# EAGLE design HoodBoard V1 (EAGLE 7.3.0)
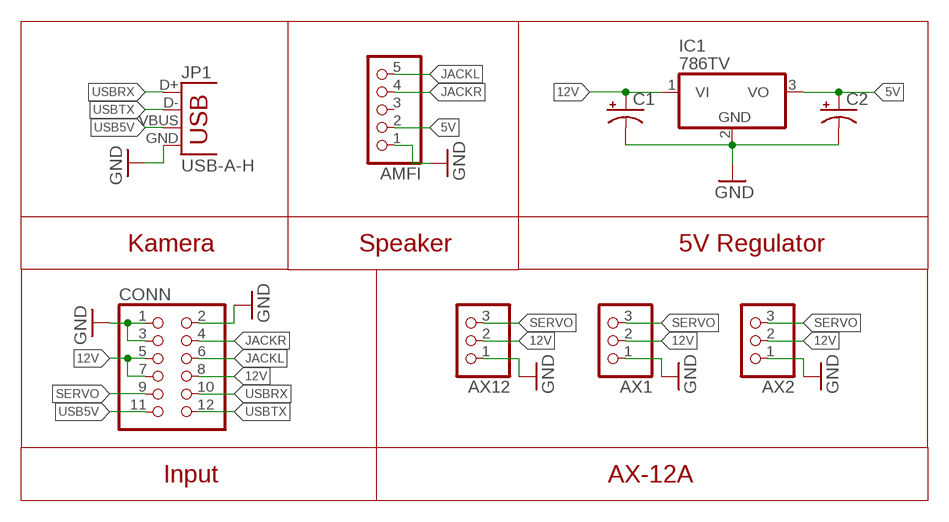
[diagram p0: schematic, sheet 1]

## Parts
AMFI  PINHD-1X5  [1X05]
AX1  PINHD-1X3  [1X03]
AX2  PINHD-1X3  [1X03]
AX12  PINHD-1X3  [1X03]
C1  10UF-25V-20%(PTH)  [CPOL-RADIAL-10UF-25V]
C2  10UF-25V-20%(PTH)  [CPOL-RADIAL-10UF-25V]
CONN  PINHD-2X6  [2X06]
IC1  786TV  [TO220V]
JP1  USB-A-H  [USB-A-H]

## Nets
5V: AMFI.2 C2.1(+) IC1.3(VO)
12V: AX1.2 AX2.2 AX12.2 C1.1(+) CONN.5 CONN.7 CONN.8 IC1.1(VI)
GND: AMFI.1 AX1.1 AX2.1 AX12.1 C1.2(-) C2.2(-) CONN.1 CONN.2 CONN.3 IC1.2(GND) JP1.GND
JACKL: AMFI.5 CONN.6
JACKR: AMFI.4 CONN.4
SERVO: AX1.3 AX2.3 AX12.3 CONN.9
USB5V: CONN.11 JP1.VBUS
USBRX: CONN.10 JP1.D+
USBTX: CONN.12 JP1.D-
Unconnected: AMFI.3

## Notes on the sheet
- Kamera | Speaker | 5V Regulator
- Input | AX-12A

## Library data of the parts
AMFI = pinhead:PINHD-1X5: PIN HEADER
AX1 AX2 AX12 = pinhead:PINHD-1X3: PIN HEADER
C1 C2 = SparkFun-Cap:10UF-25V-20%(PTH): CAP-08440; PROD_ID: CAP-08440
CONN = pinhead:PINHD-2X6: PIN HEADER
IC1 = linear:78*: Positive VOLTAGE REGULATOR Source: http://cache.national.com/ds/LM/LM78L05.pdf http://www.fairchildsemi.com/ds/LM/LM7805.pdf
JP1 = SparkFun-Connectors:USB: USB Connectors USB-B-PTH is fully proven SKU : PRT-00139/CONN-08278 USB-miniB is fully proven SKU : PRT-00587 USB-A-PCB is untested. USB-A-H is throughly reviewed, but untested. Spark Fun Electronics SKU : PRT-00437 USB-B-SMT is throughly reviewed, but untested. Needs silkscreen touching up. USB-A-S has not been used/tested USB-MB-H has not been used/tested USB-MICROB has been used. CONN-09505; PROD_ID: CONN-08367

## Net classes
0 default: width 0.4 mm, drill 1 mm

## Board
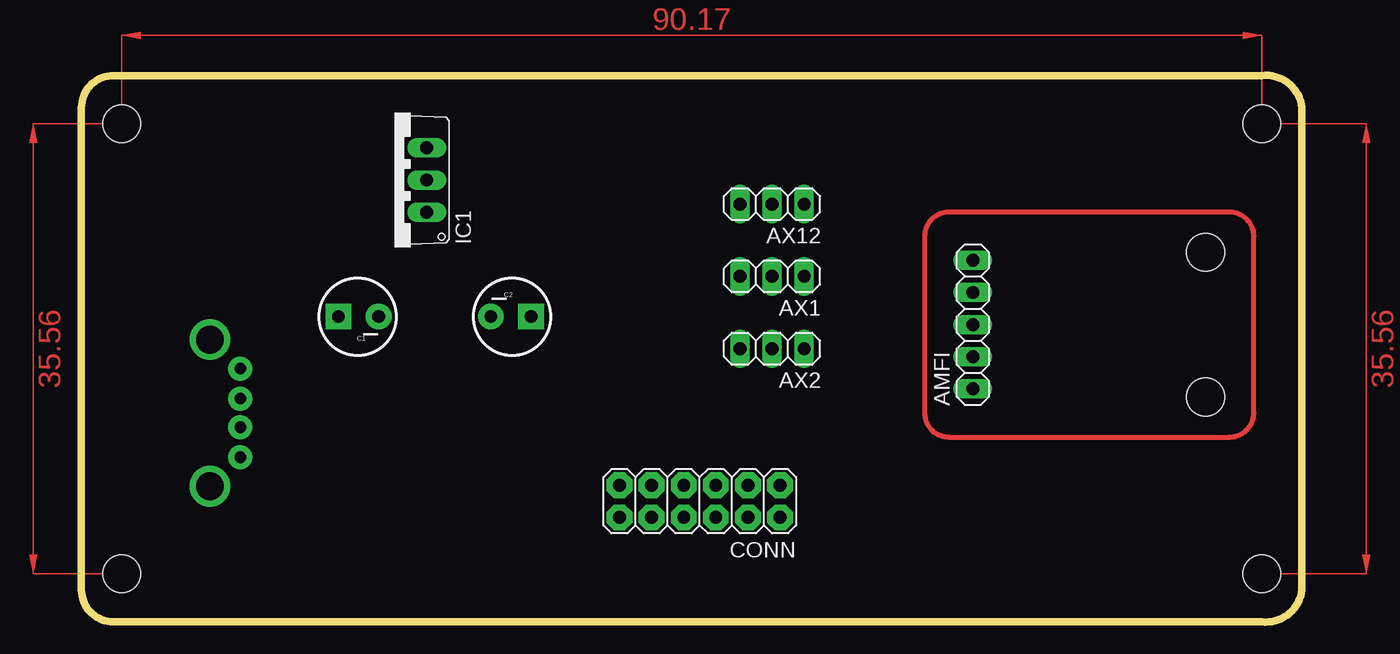
[diagram p1: board, top side]
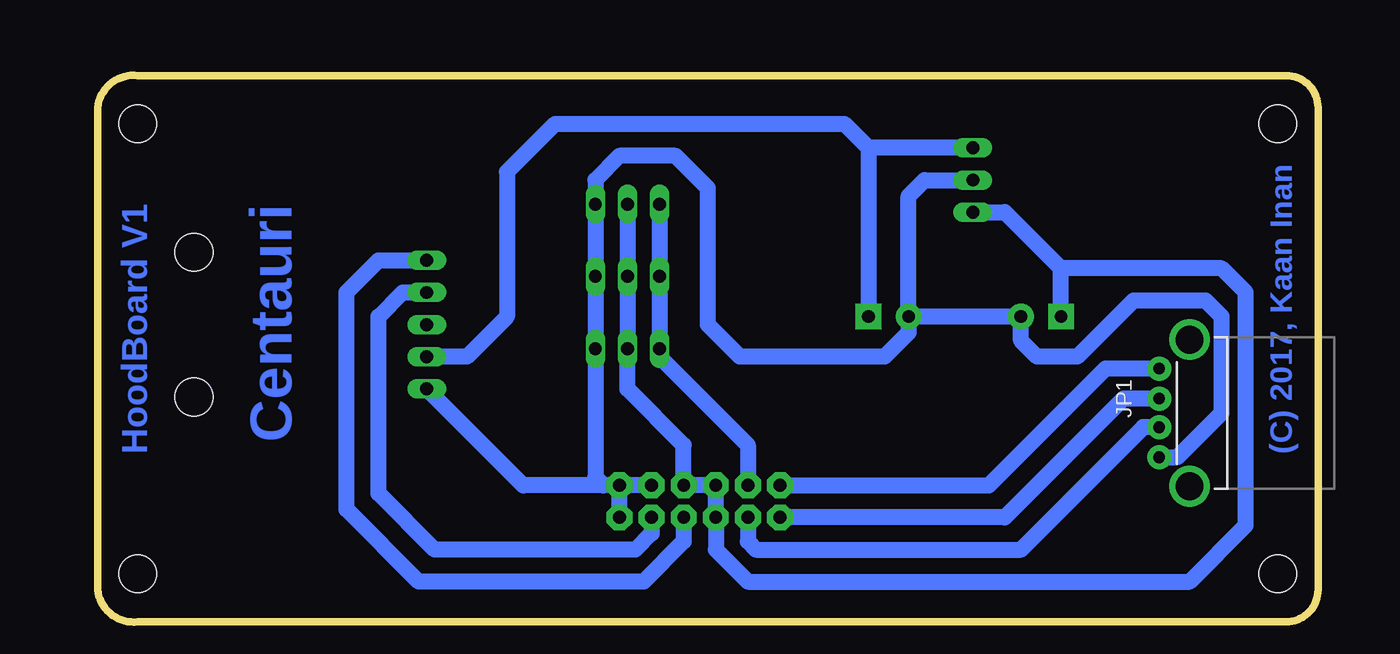
[diagram p2: board, bottom side, seen from below]

Size 96.52 x 43.21 mm. Coordinates in mm from the lower left corner, seen from the top.
Outline: 0,40.66 arc-90 2.54,43.2 93.35,43.2 arc-90 96.52,40.66 96.52,2.56 arc-90 93.35,0.02 2.54,0.02 arc-90 0,2.56 0,40.66
Copper layers (1*16): Top 0.035mm / dielectric 1.5mm / Bottom 0.035mm
Design rules "default": minimum track width 10mil, minimum drill 24mil, track to track 8mil, track to pad 8mil, pad to pad 8mil, via to via 8mil, smd to smd 8mil, copper to edge 40mil, drill to drill 8mil, minimum pad ring 10mil, minimum via ring 8mil, stop-mask expansion 4mil, vias tented up to drill 0mil, thermal gap 10mil
Holes 3 mm at 88.9,29.23 88.9,17.8 3.18,39.39 93.35,39.39 3.18,3.83 93.35,3.83

### Footprints (pad centres in the part's own frame; a part is rotated, then mirrored left to right if it is on the bottom)
1X05 = drill 1.016 long: 1 -5.08,0; 2 -2.54,0; 3 0,0; 4 2.54,0; 5 5.08,0
1X03 = drill 1.016 long: 1 -2.54,0; 2 0,0; 3 2.54,0
CPOL-RADIAL-10UF-25V = drill 1 pad 2.032 square: 1 1.27,0 | drill 1 pad 2.032: 2 -1.905,0
2X06 = drill 1.016 pad 2.032 octagon: 1 -6.35,-1.27; 2 -6.35,1.27; 3 -3.81,-1.27; 4 -3.81,1.27; 5 -1.27,-1.27; 6 -1.27,1.27; 7 1.27,-1.27; 8 1.27,1.27; 9 3.81,-1.27; 10 3.81,1.27; 11 6.35,-1.27; 12 6.35,1.27
TO220V = drill 1.016 long: 1 -2.54,-2.54; 2 0,-2.54; 3 2.54,-2.54
USB-A-H = drill 0.914 pad 1.88: D+ 2.4,1.127; D- 2.4,-1.127; GND 2.4,3.5; VBUS 2.4,-3.5 | drill 2.2: GND2 0,-5.8; GND3 0,5.8

### Placement (x,y rotation side)
AMFI  70.48,23.51 90 top
AX1  54.61,27.32 180 top
AX2  54.61,21.61 180 top
AX12  54.61,33.04 180 top
C1  21.59,24.15 180 top
C2  34.29,24.15 0 top
CONN  48.89,9.54 180 top
IC1  24.77,34.94 90 top
JP1  10.16,16.53 180 bottom

### Tracks (layer width: path | path; a pad name or v marks a point on that pad's centre or on a via)
5V
  Bottom 1.27: AMFI.2 67.31,20.97 64.14,24.15 64.14,35.58 60.33,39.39 37.47,39.39 35.56,37.48 | IC1.3 35.56,37.48 | 35.56,37.48 C2.1
12V
  Bottom 1.27: C1.1 20.32,27.96 | AX12.2 AX1.2 AX2.2 54.61,18.43 50.17,13.99 CONN.5 CONN.7 CONN.8 47.62,5.73 45.09,3.19 10.16,3.19 5.72,7.64 5.72,26.05 7.62,27.96 20.32,27.96 | IC1.1 24.77,32.4 20.32,27.96
GND
  Bottom 1.27: CONN.3 CONN.1 | CONN.1 56.52,10.81 | 56.52,10.81 62.86,10.81 AMFI.1 | CONN.2 CONN.1 | C2.2 C1.2 23.5,22.24 22.23,20.97 19.05,20.97 14.61,25.42 8.89,25.42 7.62,24.15 7.62,16.53 11.12,13.03 JP1.GND | 56.52,10.81 57.15,11.45 AX2.1 AX1.1 AX12.1 57.15,34.94 55.25,36.85 50.8,36.85 48.26,34.31 48.26,23.51 45.72,20.97 34.29,20.97 32.39,22.88 C2.2 | C2.2 32.39,33.67 31.11,34.94 IC1.2
JACKL
  Bottom 1.27: CONN.6 50.17,6.37 53.34,3.19 71.12,3.19 76.84,8.91 76.84,26.05 74.3,28.59 AMFI.5
JACKR
  Bottom 1.27: CONN.4 52.7,7 53.98,5.73 69.85,5.73 74.3,10.18 74.3,24.15 72.39,26.05 AMFI.4
N$1
  Top 0.406: 68.58,32.4 arc90 66.67,30.5 66.67,16.53 arc90 68.58,14.62 90.81,14.62 arc90 92.71,16.53 92.71,30.5 arc90 90.81,32.4 68.58,32.4
SERVO
  Bottom 1.27: AX12.3 AX1.3 AX2.3 52.07,20.97 45.09,13.99 CONN.9
USB5V
  Bottom 1.27: CONN.11 26.04,10.81 16.82,20.03 JP1.VBUS
USBRX
  Bottom 1.27: CONN.10 45.09,6.37 44.45,5.73 23.5,5.73 13.83,15.4 JP1.D+
USBTX
  Bottom 1.27: CONN.12 24.77,8.27 15.38,17.65 JP1.D-
(copper drawn outside any net)
  shapes: Top area x3

### Text on the board
Bottom: (C) 2017, Kaan Inan | Centauri | HoodBoard V1